# Altium schematic sheet STM32F405GTV6.SchDoc
size 431 x 279 mm; SheetNumber: 2; SheetTotal: 6
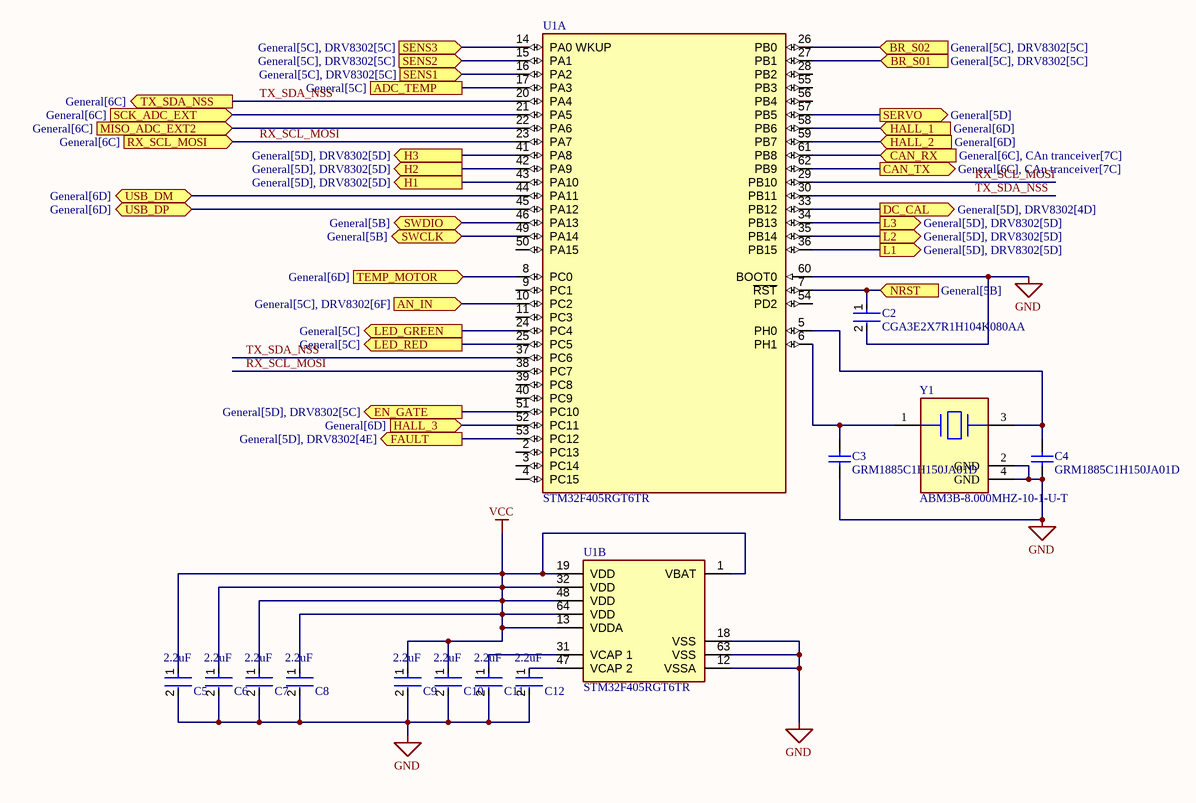
[diagram p0: STM32F405GTV6.SchDoc]

## Parts
C2  CGA3E2X7R1H104K080AA  [FP-CGA3E-0_3-0_1-IPC_A]
C3  GRM1885C1H150JA01D  [CAPC1608X90X35ML10T15]
C4  GRM1885C1H150JA01D  [CAPC1608X90X35ML10T15]
C5  Capacitance: 2.2uF  [FP-GRM188-0_1-e0_2_0_5-MFG]  (hidden comment: GRM188R71A225KE15D)
C6  Capacitance: 2.2uF  [FP-GRM188-0_1-e0_2_0_5-MFG]  (hidden comment: GRM188R71A225KE15D)
C7  Capacitance: 2.2uF  [FP-GRM188-0_1-e0_2_0_5-MFG]  (hidden comment: GRM188R71A225KE15D)
C8  Capacitance: 2.2uF  [FP-GRM188-0_1-e0_2_0_5-MFG]  (hidden comment: GRM188R71A225KE15D)
C9  Capacitance: 2.2uF  [FP-GRM188-0_1-e0_2_0_5-MFG]  (hidden comment: GRM188R71A225KE15D)
C10  Capacitance: 2.2uF  [FP-GRM188-0_1-e0_2_0_5-MFG]  (hidden comment: GRM188R71A225KE15D)
C11  Capacitance: 2.2uF  [FP-GRM188-0_1-e0_2_0_5-MFG]  (hidden comment: GRM188R71A225KE15D)
C12  Capacitance: 2.2uF  [FP-GRM188-0_1-e0_2_0_5-MFG]  (hidden comment: 2u2)
U1  STM32F405RGT6TR  [FP-LQFP64-5W-IPC_C]  (parts A,B of 2)
Y1  ABM3B-8.000MHZ-10-1-U-T  [FP-ABM3B-MFG]

## Ports
ADC_TEMP (see General[5C]), AN_IN (in, see General[5C], DRV8302[6F]), BR_S01 (in, see General[5C], DRV8302[5C]), BR_S02 (in, see General[5C], DRV8302[5C]), CAN_RX (in, see General[6C], CAn tranceiver[7C]), CAN_TX (out, see General[6C], CAn tranceiver[7C]), DC_CAL (out, see General[5D], DRV8302[4D]), EN_GATE (out, see General[5D], DRV8302[5C]), FAULT (out, see General[5D], DRV8302[4E]), H1 (out, see General[5D], DRV8302[5D]), H2 (out, see General[5D], DRV8302[5D]), H3 (out, see General[5D], DRV8302[5D]), HALL_1 (in, see General[6D]), HALL_2 (in, see General[6D]), HALL_3 (in, see General[6D]), L1 (out, see General[5D], DRV8302[5D]), L2 (out, see General[5D], DRV8302[5D]), L3 (out, see General[5D], DRV8302[5D]), LED_GREEN (out, see General[5C]), LED_RED (out, see General[5C]), MISO_ADC_EXT2 (in, see General[6C]), NRST (in, see General[5B]), RX_SCL_MOSI (in, see General[6C]), SCK_ADC_EXT (in, see General[6C]), SENS1 (in, see General[5C], DRV8302[5C]), SENS2 (in, see General[5C], DRV8302[5C]), SENS3 (in, see General[5C], DRV8302[5C]), SERVO (out, see General[5D]), SWCLK (bidir, see General[5B]), SWDIO (bidir, see General[5B]), TEMP_MOTOR (in, see General[6D]), TX_SDA_NSS (out, see General[6C]), USB_DM (bidir, see General[6D]), USB_DP (bidir, see General[6D])

## Nets
GND: C2.2 C3.1 C4.1 C5.2 C6.2 C7.2 C8.2 C9.2 C10.2 C11.2 C12.2 U1.12(VSSA) U1.18(VSS) U1.60(BOOT0) U1.63(VSS) Y1.2(GND) Y1.4(GND)
VCC: C5.1 C6.1 C7.1 C8.1 C9.1 C10.1 U1.1(VBAT) U1.13(VDDA) U1.19(VDD) U1.32(VDD) U1.48(VDD) U1.64(VDD)
ADC_TEMP: U1.17(PA3) ; port ADC_TEMP
AN_IN: U1.10(PC2) ; port AN_IN
BR_S01: U1.27(PB1) ; port BR_S01
BR_S02: U1.26(PB0) ; port BR_S02
CAN_RX: U1.61(PB8) ; port CAN_RX
CAN_TX: U1.62(PB9) ; port CAN_TX
DC_CAL: U1.33(PB12) ; port DC_CAL
EN_GATE: U1.51(PC10) ; port EN_GATE
FAULT: U1.53(PC12) ; port FAULT
H1: U1.43(PA10) ; port H1
H2: U1.42(PA9) ; port H2
H3: U1.41(PA8) ; port H3
HALL_1: U1.58(PB6) ; port HALL_1
HALL_2: U1.59(PB7) ; port HALL_2
HALL_3: U1.52(PC11) ; port HALL_3
L1: U1.36(PB15) ; port L1
L2: U1.35(PB14) ; port L2
L3: U1.34(PB13) ; port L3
LED_GREEN: U1.24(PC4) ; port LED_GREEN
LED_RED: U1.25(PC5) ; port LED_RED
MISO_ADC_EXT2: U1.22(PA6) ; port MISO_ADC_EXT2
NRST: C2.1 U1.7(~{RST}) ; port NRST
RX_SCL_MOSI: U1.23(PA7) U1.29(PB10) U1.38(PC7) ; port RX_SCL_MOSI
SCK_ADC_EXT: U1.21(PA5) ; port SCK_ADC_EXT
SENS1: U1.16(PA2) ; port SENS1
SENS2: U1.15(PA1) ; port SENS2
SENS3: U1.14(PA0_WKUP) ; port SENS3
SERVO: U1.57(PB5) ; port SERVO
SWCLK: U1.49(PA14) ; port SWCLK
SWDIO: U1.46(PA13) ; port SWDIO
TEMP_MOTOR: U1.8(PC0) ; port TEMP_MOTOR
TX_SDA_NSS: U1.20(PA4) U1.30(PB11) U1.37(PC6) ; port TX_SDA_NSS
USB_DM: U1.44(PA11) ; port USB_DM
USB_DP: U1.45(PA12) ; port USB_DP
NetC3_2: C3.2 U1.6(PH1) Y1.1
NetC4_2: C4.2 U1.5(PH0) Y1.3
NetC11_1: C11.1 U1.31(VCAP_1)
NetC12_1: C12.1 U1.47(VCAP_2)

Not connected (* = marked no-connect by the designer): U1 2(PC13) 3(PC14) 4(PC15) 9(PC1) 11(PC3) 28(PB2) 39(PC8) 40(PC9) 50(PA15) 54(PD2) 55(PB3) 56(PB4)

## Notes on the sheet
- DWG. NO.
- REV.
- SHT.
- THIS DOCUMENT AND THE DATA DISCLOSED HEREIN OR HEREWITH IS THE PROPERTY OF ALTIUM LIMITED AND MAY BE FREELY DISTRIBUTED IN WHOLE. NO RIGHTS ARE RESERVED OR EXPRESS OR IMPLIED WARANTEE GIVEN.
- REVISION
- DESCRIPTION
- DATE
- APPROVED
- ENG:
- APPROVALS
- PROJECT
- DSN:
- CHK:
- REFERENCE DOCUMENTS
- PROJECT REVISION:
- TITLE
- DOCUMENT REVISION:
- DESIGN ITEM:
- BOM:
- FAB DWG:
- PCB DWG:
- ASSY DWG:
- SCALE:
- SIZE
- B
- CAGE CODE
- FILE NAME
- DWG NO.
- SHEET
- OF
- REV

## Library data of the parts
C2 = CMP-2000-07546-2: Cap Ceramic 100nF 50V X7R 10% Pad SMD 0603 +125°C Automotive T/R; Weight: 7.1E-05oz; Composition: Ceramic; Max Operating Temperature: 125°C; Termination: SMD/SMT; Dielectric: X7R; Length: 1.6mm; Package Quantity: 1; REACH SVHC: No SVHC; Lead Free: Lead Free; Case Code (Metric): 1608; Min Operating Temperature: -55°C; Packaging: Tape and Reel; Tolerance: 10%; Voltage Rating: 50V; Case Code (Imperial): 0603; Capacitance: 100nF; Case/Package: 0603; Voltage Rating (DC): 50V; Depth: 0.8mm; Radiation Hardening: No; Ratings: AEC-Q200; Mount: Surface Mount; Voltage: 50V; Thickness: 0.035inch; Width: 0.8mm; Height: 0.8mm
C3 C4 = CMP-2006-02610-1: Manufacturer: Murata; Part Number: GRM1885C1H150JA01D
C5-C12 = CMP-2006-02836-2: Chip Multilayer Ceramic Capacitors for General Purpose, 0603, 2.2uF, X7R, 15%, 10%, 10V; Case Code (Metric): 1608; Height: 0.8mm; Packaging: Cut Tape; Voltage: 10V; Lead Free: Lead Free; Min Operating Temperature: -55°C; Voltage Rating (DC): 10V; Max Operating Temperature: 125°C; Voltage Rating: 10V; Dielectric: X7R; Depth: 0.8mm; Case Code (Imperial): 0603; Termination: SMD/SMT; Case/Package: 0603; Number of Pins: 2; REACH SVHC: No SVHC; Mount: Surface Mount; Width: 0.031inch; Material: Ceramic; Package Quantity: 1; Weight: 7.1E-05oz; Length: 1.6mm; Thickness: 0.035inch; Tolerance: 10%
U1 = CMP-0243-00156-2: IC MCU 32BIT 1MB FLASH 64LQFP; Frequency: 168MHz; Number of SPI Channels: 3; Oscillator Type: Internal; Core Architecture: ARM; Number of UART Channels: 2; Max Supply Voltage: 3.6V; Watchdog Timer: Yes; RAM Size: 196KB; Interface: I2C; Max Power Dissipation: 435mW; Number of Timers/Counters: 14; Data Bus Width: 32b; Peripherals: Brown-out Detect/Reset; Number of ADC Channels: 16; Min Supply Voltage: 1.8V; Number of Programmable I/O: 51; Memory Size: 1024KB; Max Operating Temperature: 85°C; Package Quantity: 1000; Lead Free: Lead Free; Memory Type: FLASH; Case/Package: LQFP; Number of I2C Channels: 3; Contact Plating: Tin; Mount: Surface Mount; Min Operating Temperature: -40°C; Radiation Hardening: No; Number of USB Channels: 2; Packaging: Tape and Reel; Height: 1.45mm; Number of Pins: 64; Number of I/Os: 51; Max Frequency: 168MHz; Width: 10mm; Length: 10mm
Y1 = CMP-2000-05730-2: Crystal 8MHz ±10ppm 10pF SMD-4 5mm x 3.2mm; Series Resistance: 200R; Load Capacitance: 10pF; Max Operating Temperature: 60°C; Frequency: 8MHz; Height - Seated (Max): 0.043inch; Frequency Tolerance: 10ppm; Packaging: Tape and Reel; Lead Free: Lead Free; Case/Package: SMD/SMT; Series: ABM3B; Min Operating Temperature: -10°C; REACH SVHC: No SVHC; Length: 0.197inch; RoHS Compliant: Yes; Depth: 3.2mm; Height: 0.043inch; Number of Pins: 4; Mount: Surface Mount; Frequency Stability: 10ppm; Width: 0.126inch; ESR (Equivalent Series Resistance): 200R